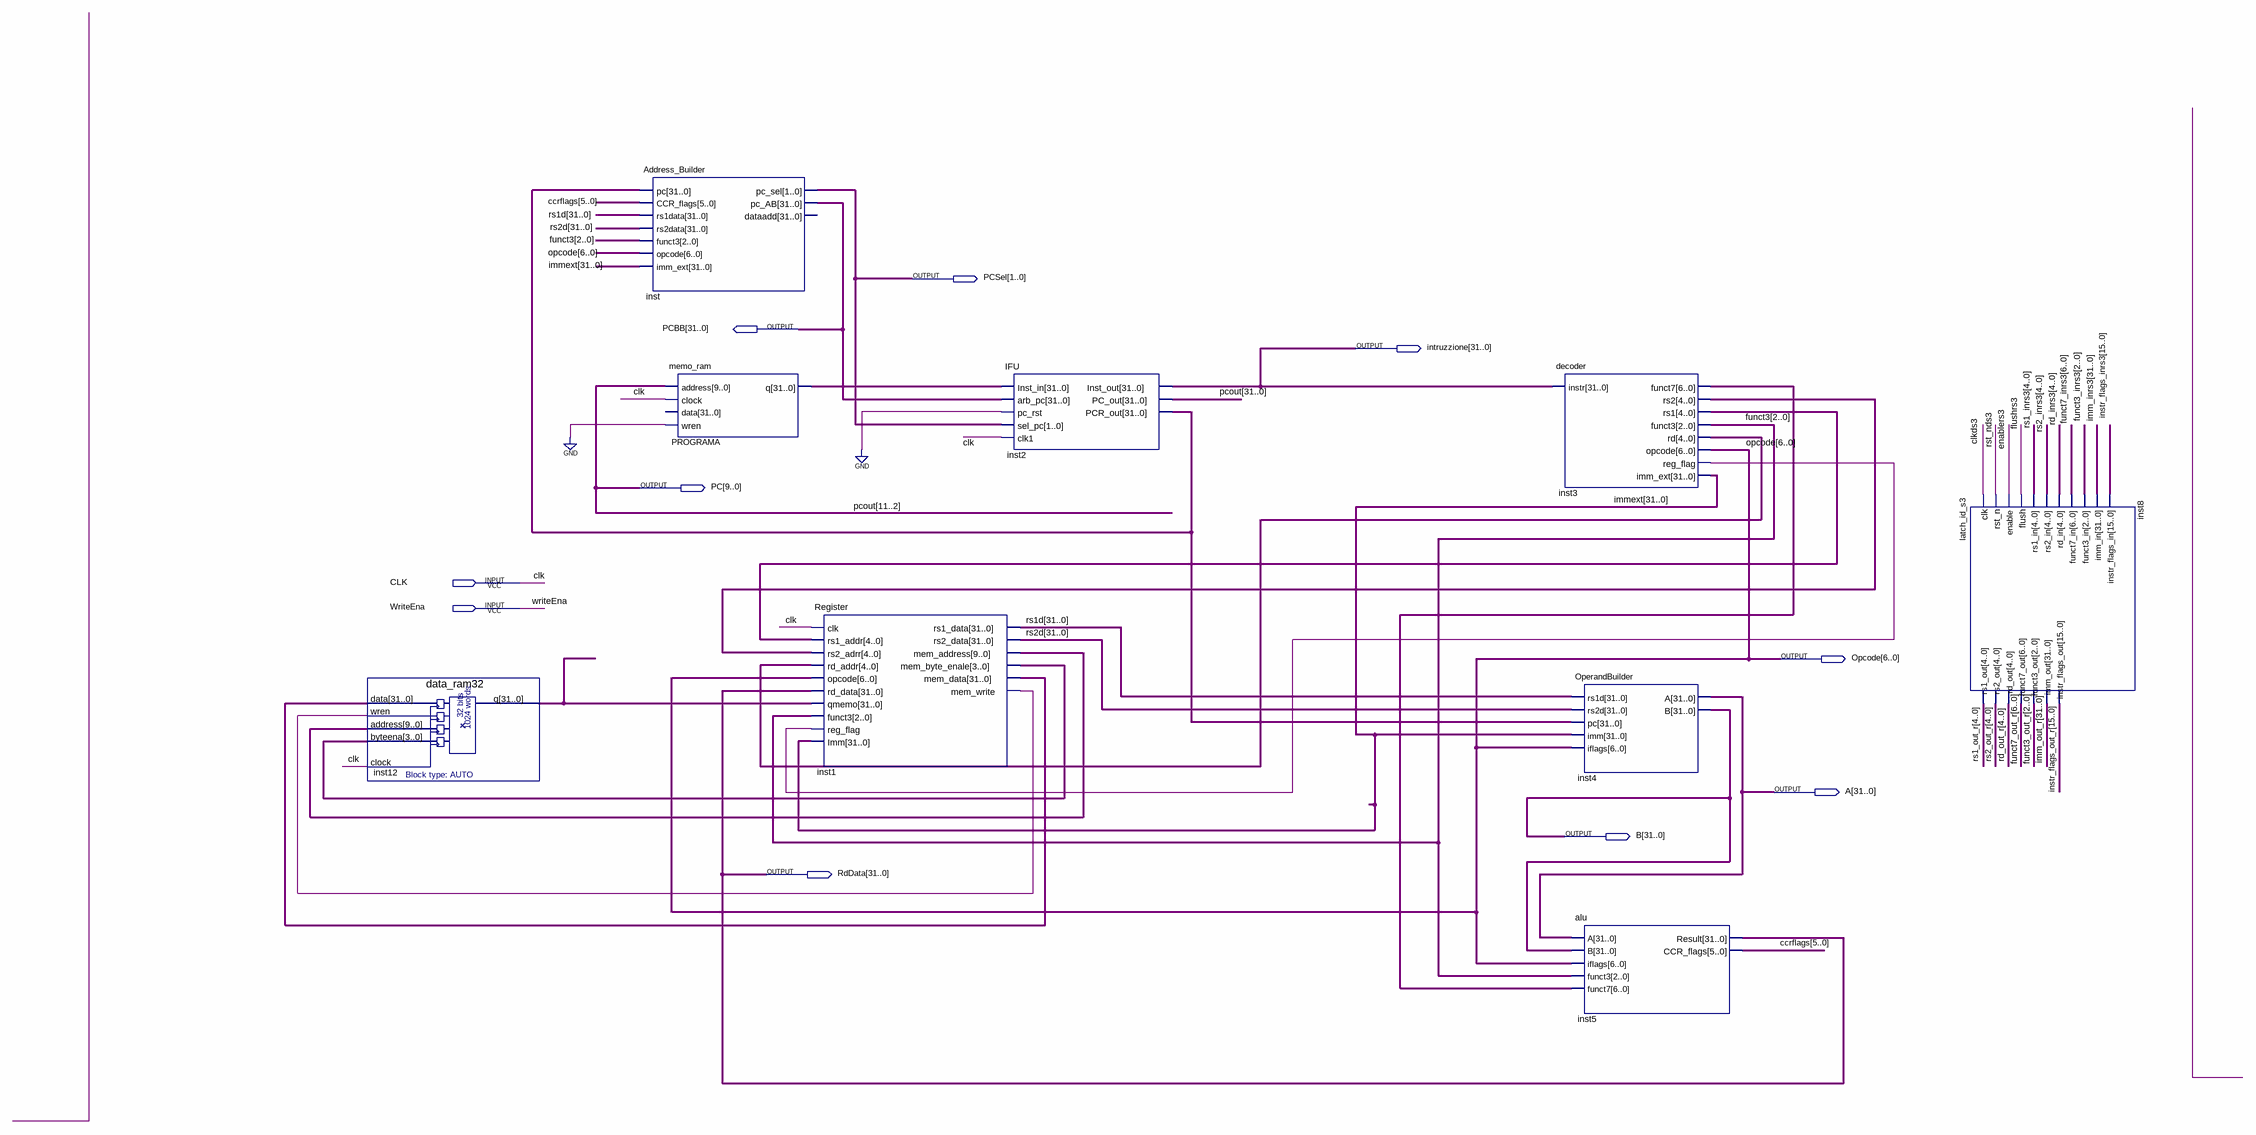
[diagram p0: schematic sheet]
// Quartus schematic latch_decode.bdf as structural Verilog: 9 symbols, 10 pins
module latch_decode (
  input  CLK,
  input  WriteEna,
  output [1:0] PCSel,
  output [31:0] PCBB,
  output [31:0] intruzzione,
  output [9:0] PC,
  output [6:0] Opcode,
  output [31:0] A,
  output [31:0] B,
  output [31:0] RdData
);

  wire clkds3, enablers3, flushrs3, inst1_mem_write, inst3_reg_flag, rst_nds3;
  wire [2:0] funct3, funct3_inrs3, funct3_out_r;
  wire [3:0] inst1_mem_byte_enale;
  wire [4:0] inst3_rd, inst3_rs1, inst3_rs2, rd_inrs3, rd_out_r, rs1_inrs3, rs1_out_r, rs2_inrs3, rs2_out_r;
  wire [5:0] ccrflags;
  wire [6:0] funct7_inrs3, funct7_out_r, inst3_funct7;
  wire [9:0] inst1_mem_address;
  wire [15:0] instr_flags_inrs3, instr_flags_out_r;
  wire [31:0] imm_inrs3, imm_out_r, immext, inst1_mem_data, inst2_pcr_out, inst12_q, pcout, PROGRAMA_q, rs1d,
       rs2d;

  data_ram32 inst12 (
    .data(inst1_mem_data), .wren(inst1_mem_write), .address(inst1_mem_address),
    .byteena(inst1_mem_byte_enale), .clock(CLK), .q(inst12_q));
  Address_Builder inst (
    .pc(inst2_pcr_out), .CCR_flags(ccrflags), .rs1data(rs1d), .rs2data(rs2d), .funct3(funct3),
    .opcode(Opcode), .imm_ext(immext), .pc_sel(PCSel), .pc_AB(PCBB));  // open: dataadd
  memo_ram PROGRAMA (.address(PC), .clock(CLK), .wren(1'b0), .q(PROGRAMA_q));  // open: data
  Register inst1 (
    .clk(CLK), .rs1_addr(inst3_rs1), .rs2_adrr(inst3_rs2), .rd_addr(inst3_rd), .opcode(Opcode),
    .rd_data(RdData), .qmemo(inst12_q), .funct3(funct3), .reg_flag(inst3_reg_flag), .Imm(immext),
    .rs1_data(rs1d), .rs2_data(rs2d), .mem_address(inst1_mem_address), .mem_byte_enale(inst1_mem_byte_enale),
    .mem_data(inst1_mem_data), .mem_write(inst1_mem_write));
  IFU inst2 (
    .Inst_in(PROGRAMA_q), .arb_pc(PCBB), .pc_rst(1'b0), .sel_pc(PCSel), .clk1(CLK), .Inst_out(intruzzione),
    .PC_out({pcout[31:12], PC, pcout[1:0]}), .PCR_out(inst2_pcr_out));
  decoder inst3 (
    .instr(intruzzione), .funct7(inst3_funct7), .rs2(inst3_rs2), .rs1(inst3_rs1), .funct3(funct3),
    .rd(inst3_rd), .opcode(Opcode), .reg_flag(inst3_reg_flag), .imm_ext(immext));
  OperandBuilder inst4 (.rs1d(rs1d), .rs2d(rs2d), .pc(inst2_pcr_out), .imm(immext), .iflags(Opcode), .A(A), .B(B));
  alu inst5 (
    .A(A), .B(B), .iflags(Opcode), .funct3(funct3), .funct7(inst3_funct7), .Result(RdData),
    .CCR_flags(ccrflags));
  latch_id_s3 inst8 (
    .clk(clkds3), .rst_n(rst_nds3), .enable(enablers3), .flush(flushrs3), .rs1_in(rs1_inrs3),
    .rs2_in(rs2_inrs3), .rd_in(rd_inrs3), .funct7_in(funct7_inrs3), .funct3_in(funct3_inrs3),
    .imm_in(imm_inrs3), .instr_flags_in(instr_flags_inrs3), .rs1_out(rs1_out_r), .rs2_out(rs2_out_r),
    .rd_out(rd_out_r), .funct7_out(funct7_out_r), .funct3_out(funct3_out_r), .imm_out(imm_out_r),
    .instr_flags_out(instr_flags_out_r));

  // Other names for the same wires on the sheet: pcout[11:2] = PC
endmodule
